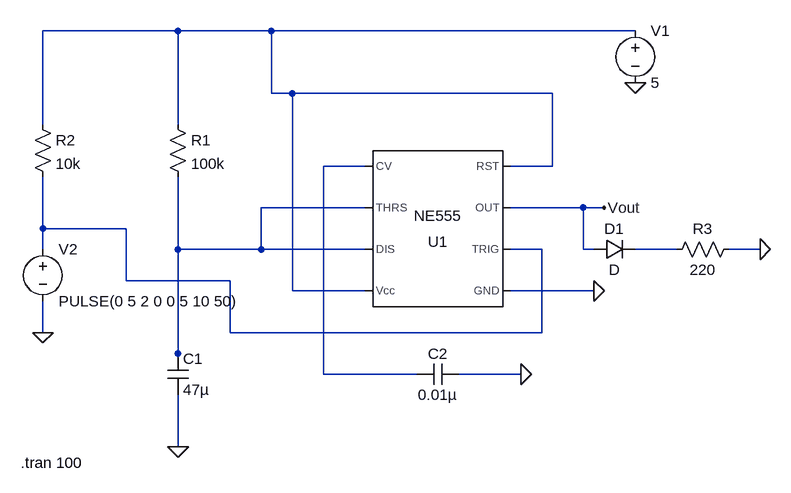
[diagram p0: schematic stable_-555.asc]
stable_-555.asc, the LTspice schematic file:
Version 4
SHEET 1 880 680
WIRE -144 -128 -352 -128
WIRE 0 -128 -144 -128
WIRE 560 -128 0 -128
WIRE 0 -32 0 -128
WIRE 32 -32 0 -32
WIRE 432 -32 32 -32
WIRE -352 16 -352 -128
WIRE -144 16 -144 -128
WIRE 144 80 80 80
WIRE 432 80 432 -32
WIRE 432 80 368 80
WIRE 144 144 -16 144
WIRE 480 144 368 144
WIRE 512 144 480 144
WIRE -352 176 -352 96
WIRE -224 176 -352 176
WIRE -352 208 -352 176
WIRE -144 208 -144 96
WIRE -16 208 -16 144
WIRE -16 208 -144 208
WIRE 144 208 -16 208
WIRE 416 208 368 208
WIRE 480 208 480 144
WIRE 496 208 480 208
WIRE 624 208 560 208
WIRE 752 208 704 208
WIRE -224 256 -224 176
WIRE -64 256 -224 256
WIRE 32 272 32 -32
WIRE 144 272 32 272
WIRE 496 272 368 272
WIRE -352 336 -352 288
WIRE -64 336 -64 256
WIRE 416 336 416 208
WIRE 416 336 -64 336
WIRE -144 368 -144 208
WIRE -144 384 -144 368
WIRE 80 400 80 80
WIRE 224 400 80 400
WIRE 384 400 288 400
WIRE -144 512 -144 432
FLAG 496 272 0
FLAG 512 144 Vout
FLAG 560 -48 0
FLAG 384 400 0
FLAG -144 512 0
FLAG -352 336 0
FLAG 752 208 0
SYMBOL Misc\\NE555 256 176 R180
SYMATTR InstName U1
SYMBOL voltage 560 -144 R0
WINDOW 123 0 0 Left 0
WINDOW 39 0 0 Left 0
SYMATTR InstName V1
SYMATTR Value 5
SYMBOL res -160 0 R0
SYMATTR InstName R1
SYMATTR Value 100k
SYMBOL cap 288 384 R90
WINDOW 0 0 32 VBottom 2
WINDOW 3 32 32 VTop 2
SYMATTR InstName C2
SYMATTR Value 0.01µ
SYMBOL cap -160 368 R0
SYMATTR InstName C1
SYMATTR Value 47µ
SYMBOL res -368 0 R0
SYMATTR InstName R2
SYMATTR Value 10k
SYMBOL voltage -352 192 R0
WINDOW 123 0 0 Left 0
WINDOW 39 0 0 Left 0
SYMATTR InstName V2
SYMATTR Value PULSE(0 5 2 0 0 5 10 50)
SYMBOL diode 496 224 R270
WINDOW 0 32 32 VTop 2
WINDOW 3 0 32 VBottom 2
SYMATTR InstName D1
SYMBOL res 720 192 R90
WINDOW 0 0 56 VBottom 2
WINDOW 3 32 56 VTop 2
SYMATTR InstName R3
SYMATTR Value 220
TEXT -386 536 Left 2 !.tran 100

The netlist it stands for:
* stable_-555.asc
XU1 0 N004 Vout N001 N002 N003 N003 N001 NE555  ; pins GND TRIG OUT RST CV THRS DIS Vcc
V1 N001 0 5
R1 N001 N003 100k
C2 0 N002 0.01µ
C1 N003 0 47µ
R2 N001 N004 10k
V2 N004 0 PULSE(0 5 2 0 0 5 10 50)
D1 Vout N005 D
R3 0 N005 220
.model D D
.lib standard.dio
.tran 100
.lib NE555.sub
.backanno
.end